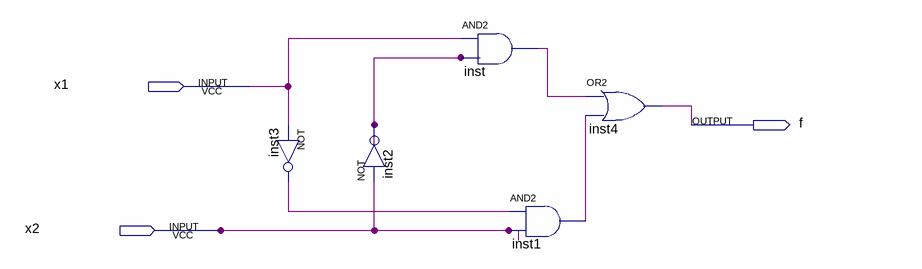
[diagram p0: schematic sheet]
// Quartus schematic light.bdf as structural Verilog: 5 symbols, 3 pins
module light (
  input  x1,
  input  x2,
  output f
);

  wire inst1_out, inst2_out, inst3_out, inst_out;

  not inst3 (inst3_out, x1);
  not inst2 (inst2_out, x2);
  and inst (inst_out, x1, inst2_out);
  and inst1 (inst1_out, inst3_out, x2);
  or inst4 (f, inst_out, inst1_out);
endmodule
